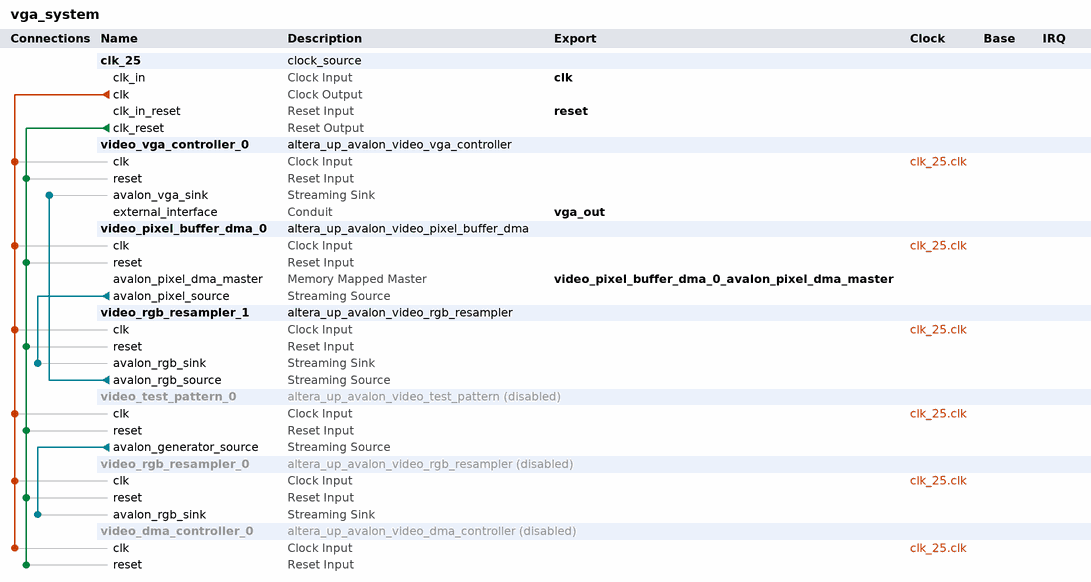
[diagram p0: system contents]
# Platform Designer (Qsys) system vga_system, Cyclone V 5CSEMA5F31C6
# Parameters at their usual value, and those the tool derives, are not listed.
package require -exact qsys 18.0
create_system vga_system
set_project_property DEVICE_FAMILY {Cyclone V}
set_project_property DEVICE 5CSEMA5F31C6

add_instance clk_25 clock_source 18.1
set_instance_parameter_value clk_25 clockFrequency 25000000

add_instance video_vga_controller_0 altera_up_avalon_video_vga_controller 18.0
set_instance_parameter_value video_vga_controller_0 board DE1-SoC
set_instance_parameter_value video_vga_controller_0 resolution {VGA 640x480}

add_instance video_pixel_buffer_dma_0 altera_up_avalon_video_pixel_buffer_dma 18.0
set_instance_parameter_value video_pixel_buffer_dma_0 addr_mode X-Y
set_instance_parameter_value video_pixel_buffer_dma_0 back_start_address 0
set_instance_parameter_value video_pixel_buffer_dma_0 color_space {24-bit RGB}
set_instance_parameter_value video_pixel_buffer_dma_0 image_height 480
set_instance_parameter_value video_pixel_buffer_dma_0 image_width 640
set_instance_parameter_value video_pixel_buffer_dma_0 start_address 0

add_instance video_rgb_resampler_1 altera_up_avalon_video_rgb_resampler 18.0
set_instance_parameter_value video_rgb_resampler_1 alpha 1023
set_instance_parameter_value video_rgb_resampler_1 input_type {24-bit RGB}
set_instance_parameter_value video_rgb_resampler_1 output_type {30-bit RGB}

add_instance video_test_pattern_0 altera_up_avalon_video_test_pattern 18.0
set_instance_property video_test_pattern_0 ENABLED false
set_instance_parameter_value video_test_pattern_0 height 480
set_instance_parameter_value video_test_pattern_0 width 640

add_instance video_rgb_resampler_0 altera_up_avalon_video_rgb_resampler 18.0
set_instance_property video_rgb_resampler_0 ENABLED false
set_instance_parameter_value video_rgb_resampler_0 alpha 1023
set_instance_parameter_value video_rgb_resampler_0 input_type {24-bit RGB}
set_instance_parameter_value video_rgb_resampler_0 output_type {30-bit RGB}

add_instance video_dma_controller_0 altera_up_avalon_video_dma_controller 18.0
set_instance_property video_dma_controller_0 ENABLED false
set_instance_parameter_value video_dma_controller_0 addr_mode X-Y
set_instance_parameter_value video_dma_controller_0 back_start_address 0
set_instance_parameter_value video_dma_controller_0 color_bits 10
set_instance_parameter_value video_dma_controller_0 color_planes 3
set_instance_parameter_value video_dma_controller_0 dma_enabled true
set_instance_parameter_value video_dma_controller_0 height 480
set_instance_parameter_value video_dma_controller_0 mode {From Memory to Stream}
set_instance_parameter_value video_dma_controller_0 start_address 0
set_instance_parameter_value video_dma_controller_0 width 640

# connections
add_connection clk_25.clk video_dma_controller_0.clk clock
add_connection clk_25.clk video_pixel_buffer_dma_0.clk clock
add_connection clk_25.clk video_rgb_resampler_0.clk clock
add_connection clk_25.clk video_rgb_resampler_1.clk clock
add_connection clk_25.clk video_test_pattern_0.clk clock
add_connection clk_25.clk video_vga_controller_0.clk clock
add_connection clk_25.clk_reset video_dma_controller_0.reset reset
add_connection clk_25.clk_reset video_pixel_buffer_dma_0.reset reset
add_connection clk_25.clk_reset video_rgb_resampler_0.reset reset
add_connection clk_25.clk_reset video_rgb_resampler_1.reset reset
add_connection clk_25.clk_reset video_test_pattern_0.reset reset
add_connection clk_25.clk_reset video_vga_controller_0.reset reset
add_connection video_pixel_buffer_dma_0.avalon_pixel_source video_rgb_resampler_1.avalon_rgb_sink avalon_streaming
add_connection video_rgb_resampler_1.avalon_rgb_source video_vga_controller_0.avalon_vga_sink avalon_streaming
add_connection video_test_pattern_0.avalon_generator_source video_rgb_resampler_0.avalon_rgb_sink avalon_streaming

# exported interfaces
add_interface clk clock sink
set_interface_property clk EXPORT_OF clk_25.clk_in
add_interface reset reset sink
set_interface_property reset EXPORT_OF clk_25.clk_in_reset
add_interface vga_out conduit end
set_interface_property vga_out EXPORT_OF video_vga_controller_0.external_interface
add_interface video_pixel_buffer_dma_0_avalon_pixel_dma_master avalon master
set_interface_property video_pixel_buffer_dma_0_avalon_pixel_dma_master EXPORT_OF video_pixel_buffer_dma_0.avalon_pixel_dma_master

set_interconnect_requirement {$system} qsys_mm.clockCrossingAdapter HANDSHAKE
set_interconnect_requirement {$system} qsys_mm.enableEccProtection FALSE
set_interconnect_requirement {$system} qsys_mm.insertDefaultSlave FALSE
set_interconnect_requirement {$system} qsys_mm.maxAdditionalLatency 1

save_system vga_system.qsys
